# EAGLE design 0351_AD_ConverterRev020001 (EAGLE 9.6.2)
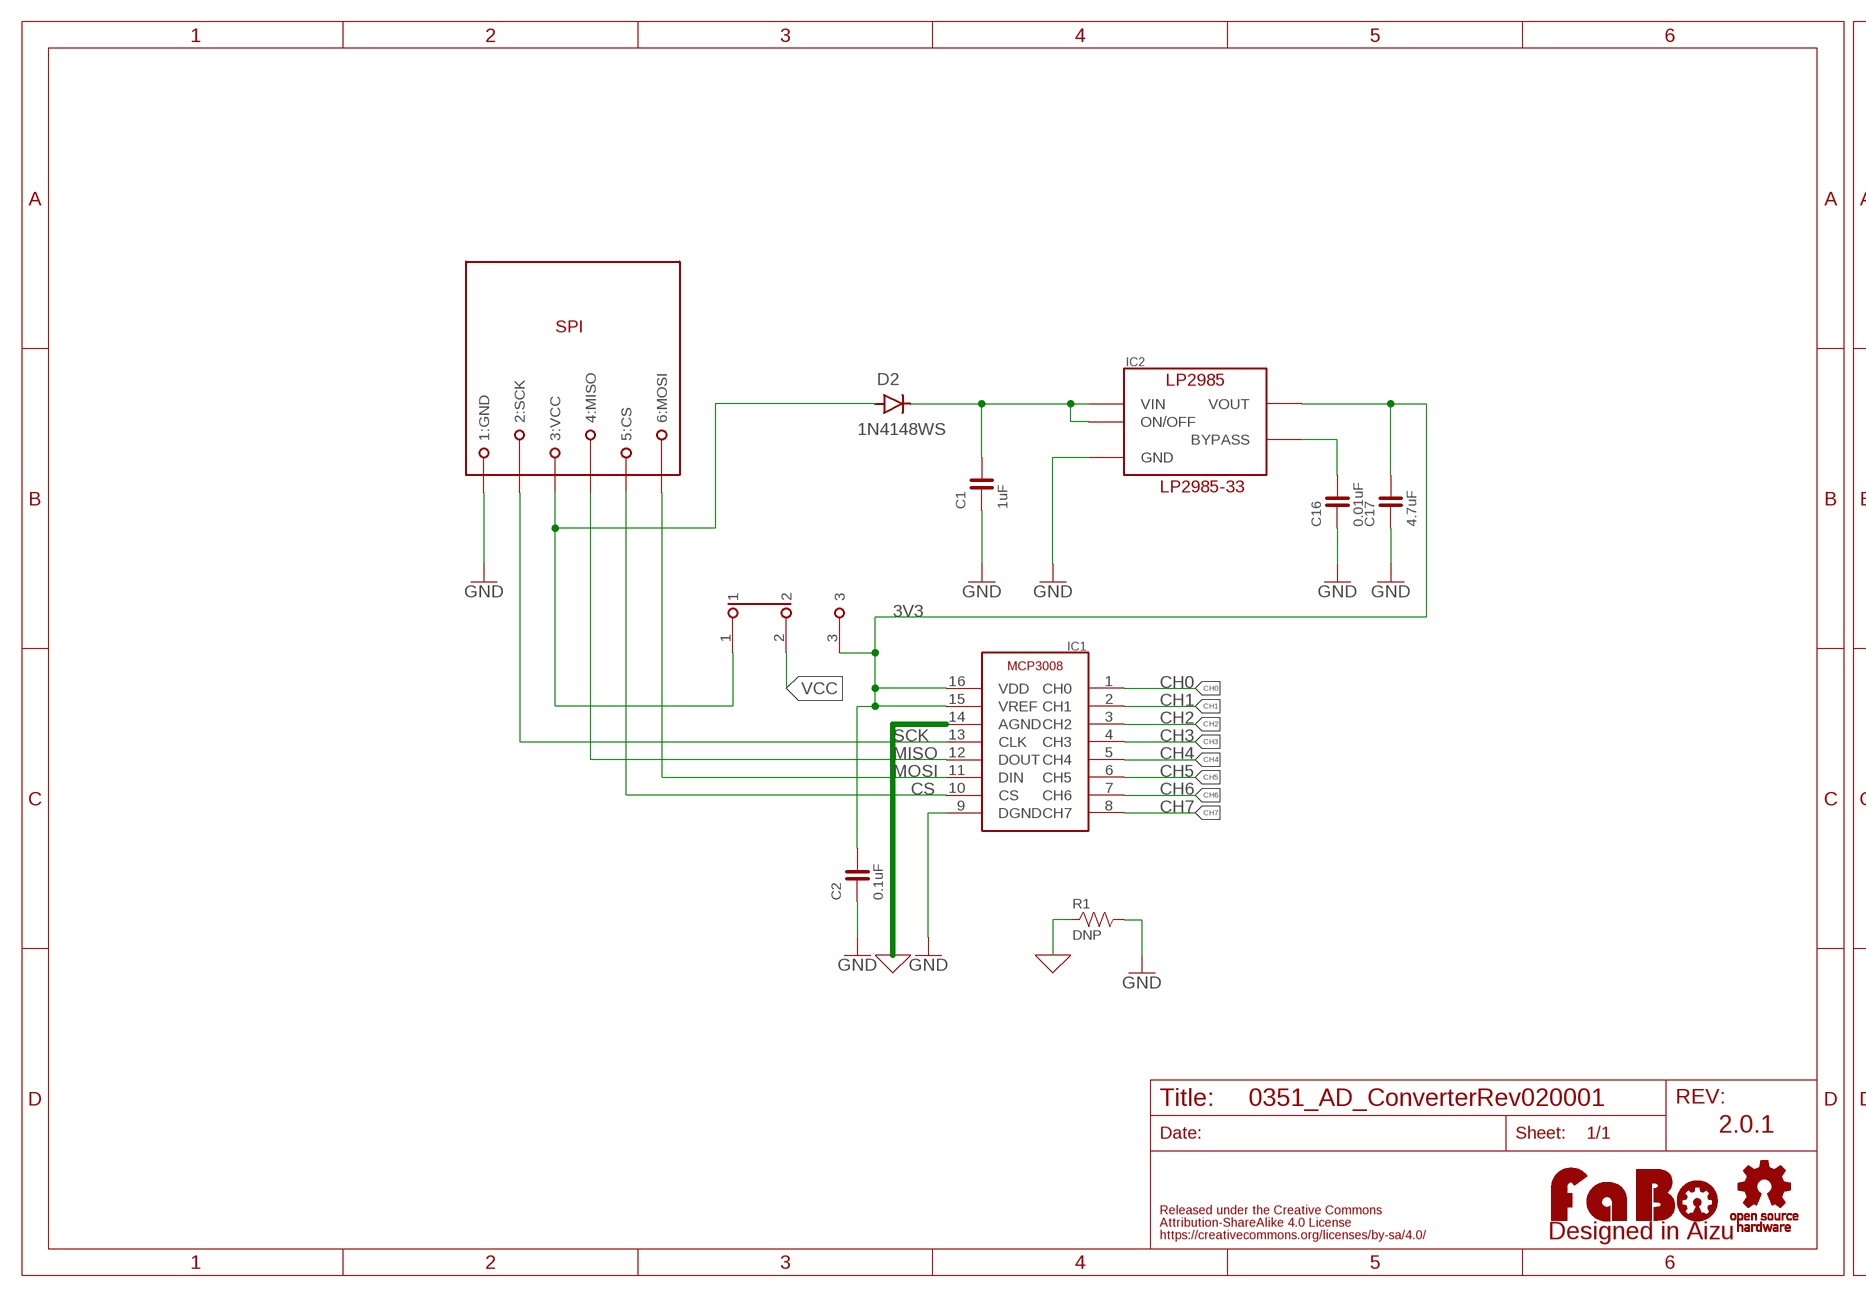
[diagram p0: schematic, sheet 1, part 1 of 2]
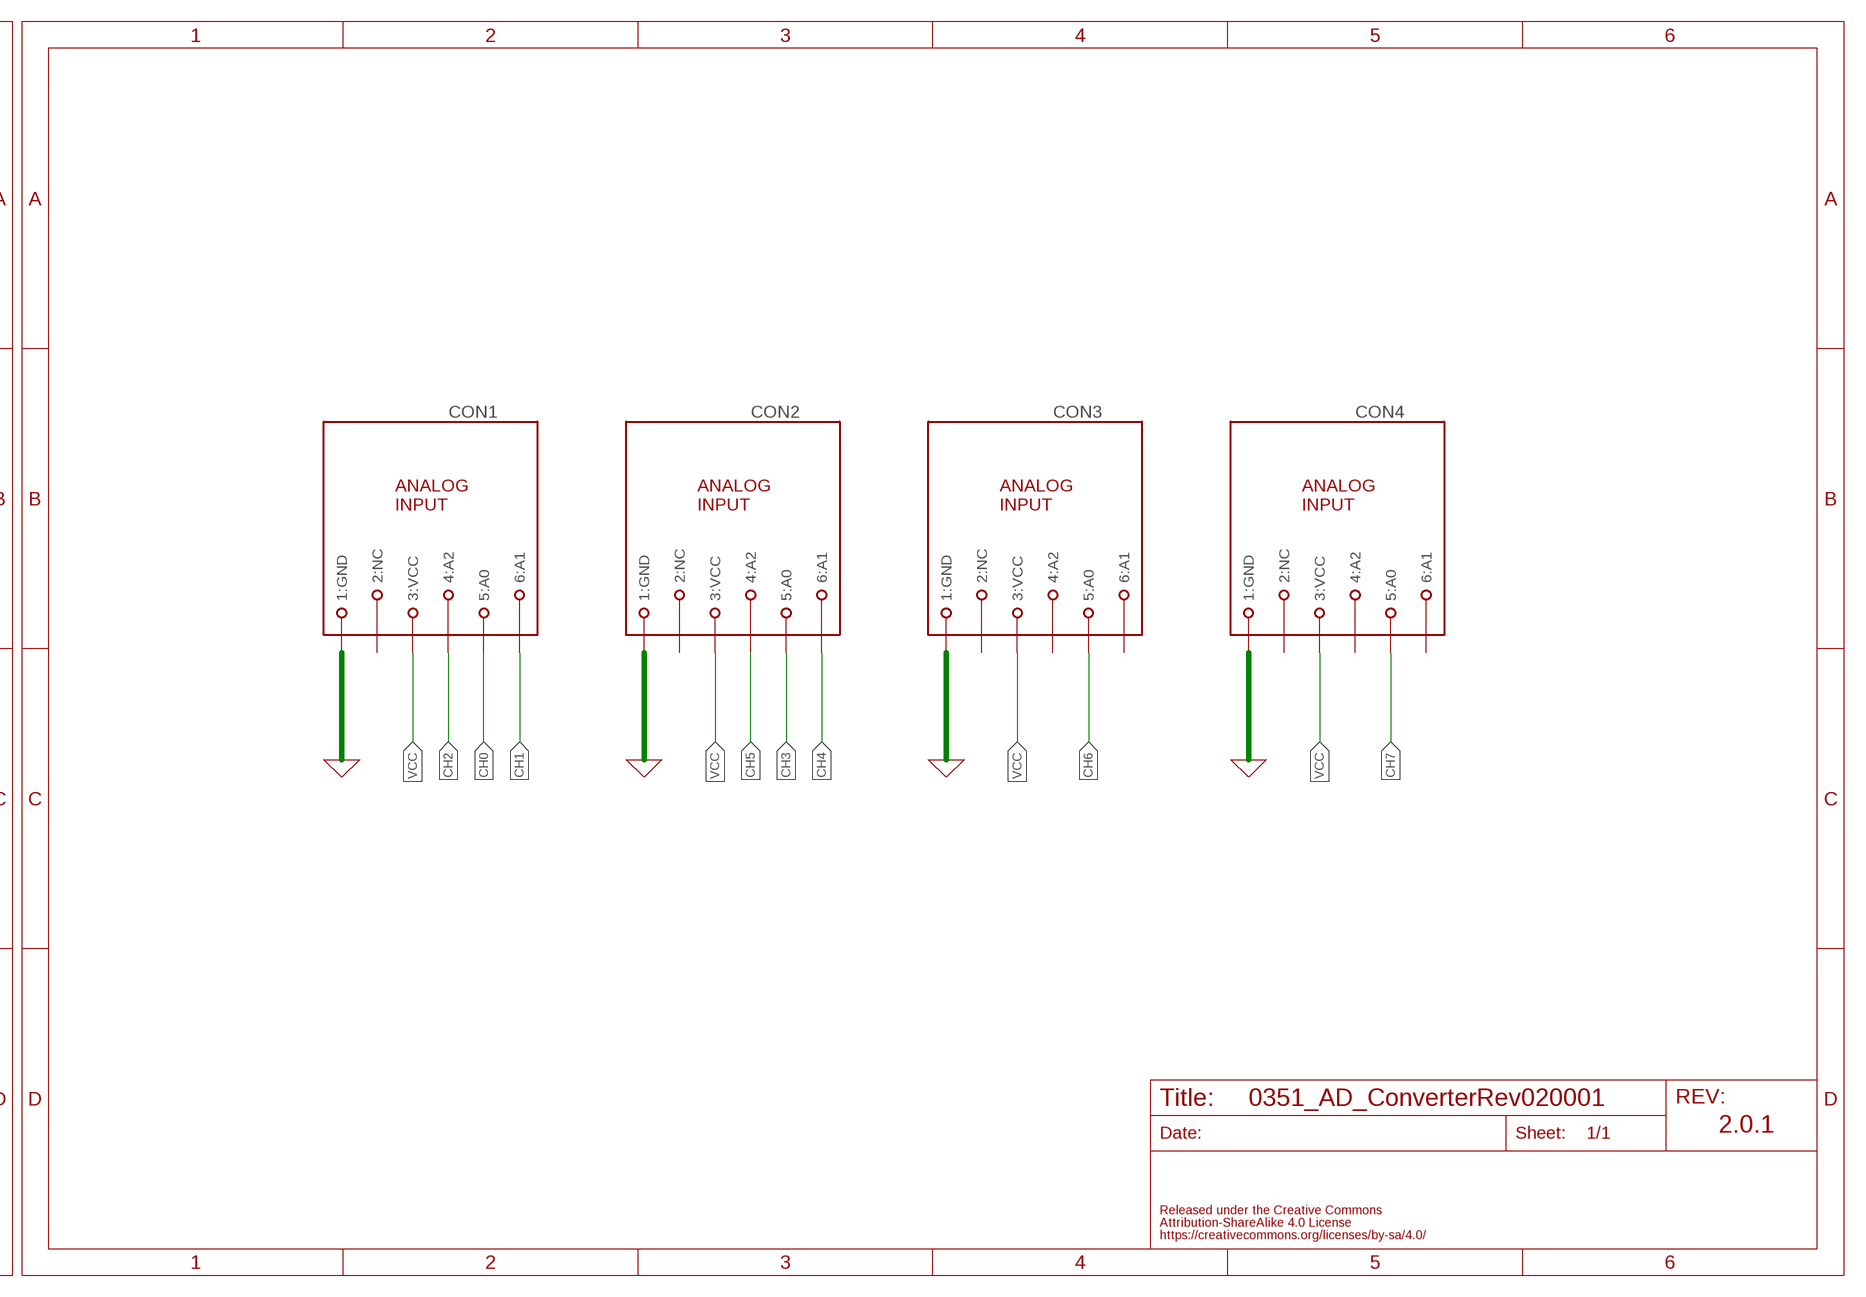
[diagram p1: schematic, sheet 1, part 2 of 2]

## Parts
C1  1uF  CAPACITOR-0603  [0603]
C2  0.1uF  CAPACITOR-0603  [0603]
C16  0.01uF  CAPACITOR-0603  [0603]
C17  4.7uF  CAPACITOR-0603  [0603]
CON1  MODULAR-JACK-6P-RJ11_ANALOG3  [7002-6PXC-X]
CON2  MODULAR-JACK-6P-RJ11_ANALOG3  [7002-6PXC-X]
CON3  MODULAR-JACK-6P-RJ11_ANALOG3  [7002-6PXC-X]
CON4  MODULAR-JACK-6P-RJ11_ANALOG3  [7002-6PXC-X]
D2  1N4148WS  [SOD-323]
IC1  MICROCHIP-MCP3008  [MICROCHIP-MCP3008]
IC2  LP2985-33DBV  [SOT-23-5]
LCD-SPI_RJ11  MODULAR-JACK-6P-RJ11_SPI  [7002-6PXC-X]
LOGO1  LOGO_FABO-M_BOTTOM  [LOGO_FABO_M_BOTTOM]
R1  DNP  RESISTOR-0805  [0805]
U$3  LOGO_OSHW-M_BOTTOM  [LOGO_OSHW_M_BOTTOM]
U$5  SSSS213202  [SSSS213202]

## Nets
3V3: C2.2 C17.2 IC1.15(VREF) IC1.16(VDD) IC2.5(VOUT) U$5.3
AGND: CON1.1(1:GND) CON2.1(1:GND) CON3.1(1:GND) CON4.1(1:GND) IC1.14(AGND) R1.1 ; supply symbol labelled GND
CH0: CON1.5(5:A0) IC1.1(CH0)
CH1: CON1.6(6:A1) IC1.2(CH1)
CH2: CON1.4(4:A2) IC1.3(CH2)
CH3: CON2.5(5:A0) IC1.4(CH3)
CH4: CON2.6(6:A1) IC1.5(CH4)
CH5: CON2.4(4:A2) IC1.6(CH5)
CH6: CON3.5(5:A0) IC1.7(CH6)
CH7: CON4.5(5:A0) IC1.8(CH7)
CS: IC1.10(CS) LCD-SPI_RJ11.5(5:CS)
GND: C1.1 C2.1 C16.1 C17.1 IC1.9(DGND) IC2.2(GND) LCD-SPI_RJ11.1(1:GND) R1.2
MISO: IC1.12(DOUT) LCD-SPI_RJ11.4(4:MISO)
MOSI: IC1.11(DIN) LCD-SPI_RJ11.6(6:MOSI)
N$7: C16.2 IC2.4(BYPASS)
N$8: C1.2 D2.C IC2.1(VIN) IC2.3(ON/OFF)
SCK: IC1.13(CLK) LCD-SPI_RJ11.2(2:SCK)
VCC: CON1.3(3:VCC) CON2.3(3:VCC) CON3.3(3:VCC) CON4.3(3:VCC) U$5.2
VCC_IN: D2.A LCD-SPI_RJ11.3(3:VCC) U$5.1
Unconnected: CON1.2(2:NC) CON2.2(2:NC) CON3.2(2:NC) CON3.4(4:A2) CON3.6(6:A1) CON4.2(2:NC) CON4.4(4:A2) CON4.6(6:A1)

## Notes on the sheet
- LP2985-33
- 2.0.1 | 2.0.1

## Library data of the parts
C1 C2 C16 C17 = FaBo-Capacitor:CAPACITOR: CAPACITOR
CON1 CON2 CON4 = FaBo-Connetor:MODULAR-JACK-6P-RJ11_ANALOG3
CON3 = FaBo-Connetor:MODULAR-JACK-6P-RJ11_ANALOG3; SPICEPREFIX: X
D2 = Diodes:1N4148WS: DIODE GEN PURP 75V 150MA SOD323F Manufacturer's datasheet <https://www.onsemi.com/pub/Collateral/1N914BWS-D.pdf>; CREATED_BY: PCBLayout.com; DIGIKEY_PART_NUMBER: 1N4148WSFSTR-ND; MANUFACTURER: Diodes Incorporated; MPN: 1N4148WS; PACKAGE: SOD-323
IC1 = FaBo-ADC:MICROCHIP-MCP3008
IC2 = FaBo-Supply:LP2985: LP2985
LCD-SPI_RJ11 = FaBo-Connetor:MODULAR-JACK-6P-RJ11_SPI
LOGO1 = component:LOGO_FABO
R1 = FaBo-Resistors:RESISTOR: RESISTOR
U$3 = component:LOGO_OSHW
U$5 = FaBo-Switch:SSSS213202

## Board
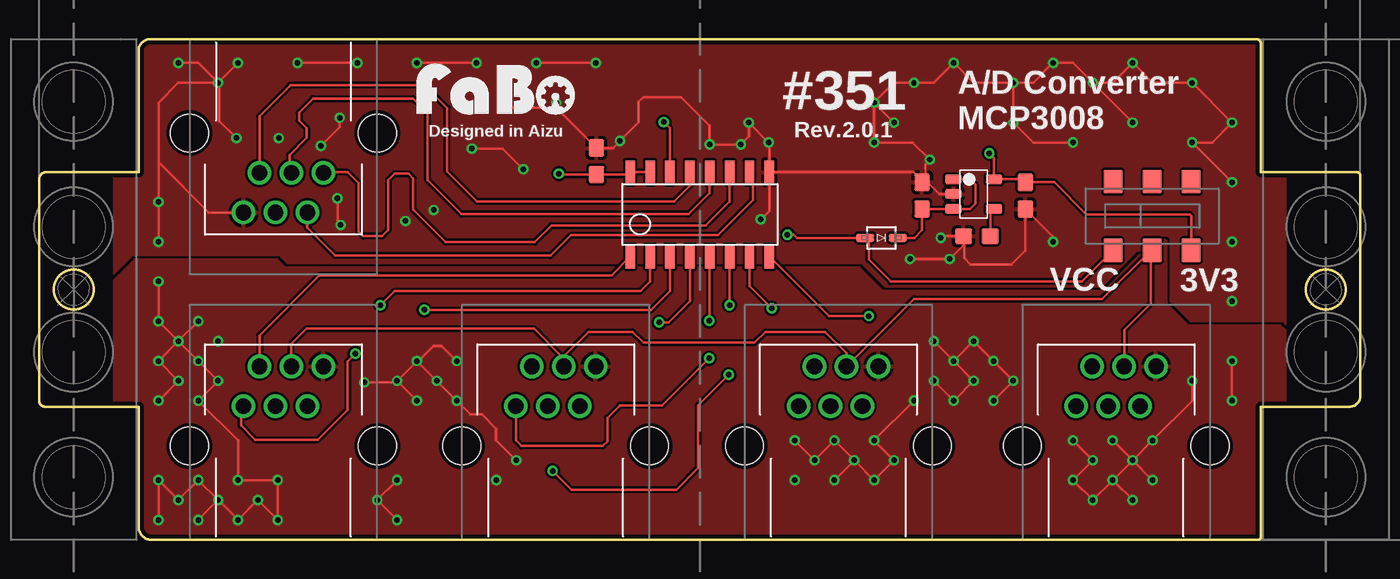
[diagram p2: board, top side]
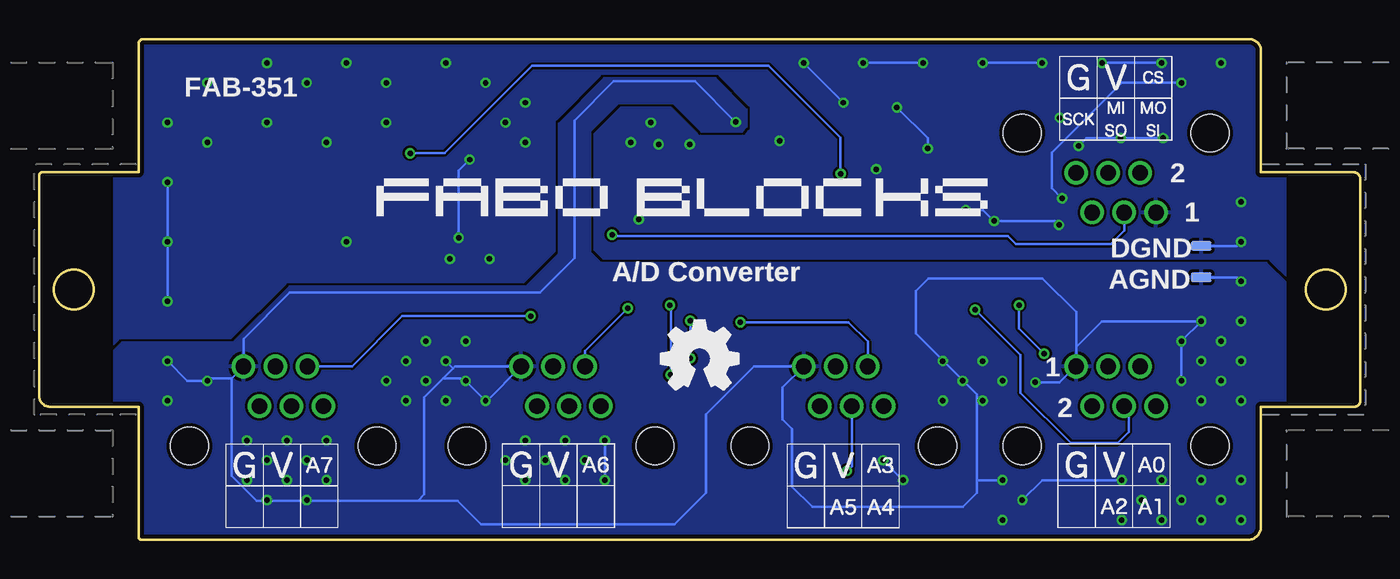
[diagram p3: board, bottom side, seen from below]

Size 84.4 x 32 mm. Coordinates in mm from the lower left corner, seen from the top.
Outline: 7.15,32 77.75,32 arc-90 78.05,31.7 78.05,23.5 84.1,23.5 arc-90 84.4,23.3 84.4,9.2 arc-90 83.7,8.5 78.05,8.5 78.05,0.2 arc-90 77.85,0 7.2,0 arc-90 6.35,0.8 6.35,8.5 0.4,8.5 arc-90 0,8.9 0,23 arc-90 0.4,23.5 6.35,23.5 6.35,31.3 arc-90 7.15,32
Outline: circle at 82.2,16 radius 1.27
Outline: circle at 2.2,16 radius 1.27
Copper layers (1*16): Top 0.035mm / dielectric 1.6mm / Bottom 0.035mm
Design rules "PCBway": minimum track width 6mil, minimum drill 12mil, track to track 6mil, track to pad 6mil, pad to pad 6mil, via to via 6mil, smd to smd 6mil, copper to edge 10mil, drill to drill 10mil, minimum pad ring 10mil, minimum via ring 6mil, stop-mask expansion 2mil, vias tented up to drill 100mil, thermal gap 8mil
tRestrict: area -1.2,7.3 to 4.7,24.4; area 79.7,7.4 to 85.6,24.5
bRestrict: area -1.2,6.6 to 4.7,23.7; area 79.7,7.4 to 85.6,24.5

### Footprints (pad centres in the part's own frame; a part is rotated, then mirrored left to right if it is on the bottom)
0603 = smd 1.1 x 1: 1 -0.85,0; 2 0.85,0
7002-6PXC-X = drill 1: 1 2.55,5.08; 2 1.53,2.54; 3 0.51,5.08; 4 -0.51,2.54; 5 -1.53,5.08; 6 -2.55,2.54 | hole 2.4: -6,0; 6,0
SOD-323 = smd 1.14 x 0.52: A 1.04,0; C -1.04,0
MICROCHIP-MCP3008 = smd 0.6 x 1.5: 1 -4.445,-2.7; 2 -3.175,-2.7; 3 -1.905,-2.7; 4 -0.635,-2.7; 5 0.635,-2.7; 6 1.905,-2.7; 7 3.175,-2.7; 8 4.445,-2.7; 9 4.445,2.7; 10 3.175,2.7; 11 1.905,2.7; 12 0.635,2.7; 13 -0.635,2.7; 14 -1.905,2.7; 15 -3.175,2.7; 16 -4.445,2.7
SOT-23-5 = smd 0.6 x 1.05: 1 -0.95,-1.3; 2 0,-1.3; 3 0.95,-1.3; 4 0.95,1.3; 5 -0.95,1.3
0805 = smd 0.6 x 1.3: 1 -1,0; 2 1,0
SSSS213202 = smd 1.2 x 1.5: 1 -2.5,-2.2; 2 0,-2.2; 3 2.5,-2.2; 4 2.5,2.2; 5 0,2.2; 6 -2.5,2.2

### Placement (x,y rotation side)
C1  56.4,22 270 top
C2  35.6,24.2 270 top
C16  59.9,19.4 0 top
C17  63,22 90 top
CON1  15.6,6 0 top
CON2  33,6 0 top
CON3  51.06,6 0 top
CON4  68.8,6 0 top
D2  53.8,19.3 180 top
IC1  42.2,20.8 0 top
IC2  59.7,22.1 270 top
LCD-SPI_RJ11  15.6,26 180 top
LOGO1  29.17,26.8 0 bottom
R1  10.16,17.78 90 bottom
U$2  [4-1BLOCK]  2.2,16 0 top
U$3  42.2,11.58 0 top
U$4  [4-1BLOCK]  82.2,16 180 top
U$5  71.1,20.7 0 top

### Tracks (layer width: path | path; a pad name or v marks a point on that pad's centre or on a via)
3V3  (via drill 0.35)
  Top 0.152: U$5.3 73.6,20.7 73.5,20.8 66.9,20.8 64.85,22.85 63.1,22.85 | 63.1,22.85 C17.2 | 63.1,22.85 62.9,23.05 IC2.5 61,24.4 v60.7,24.7 | IC1.15 IC1.16 37.61,23.35 C2.2 33.25,23.35 v33.2,23.4
  Bottom 0.152: v33.2,23.4 33.2,25.7 37.8,30.3 52.9,30.3 58.5,24.7 v60.7,24.7
AGND  (via drill 0.35)
  Top 0.152: IC1.14 40.3,26.3 v39.9,26.7 | v55.88,8.89 v53.34,6.35 v54.61,5.08 v53.34,3.81 v52.07,5.08 | v7.62,1.27 v7.62,3.81 v8.89,2.54 v10.16,3.81 v11.43,2.54 | v11.43,2.54 v10.16,1.27 | v11.43,2.54 v12.7,1.27 v13.97,2.54 v15.24,1.27 v15.24,3.81 v12.7,3.81 12.7,6.35 v10.16,8.89 v11.43,10.16 v10.16,11.43 v8.89,12.7 | v7.62,8.89 v8.89,10.16 v7.62,11.43 v8.89,12.7 | v8.89,12.7 v7.62,13.97 v7.62,16.51 | v8.89,12.7 v10.16,13.97 | 24.18,11.38 v24.13,11.43 v22.86,10.16 | 24.18,11.38 v25.4,10.16 v26.67,8.89 27.56,8 28.3,8 29.2,7.1 29.2,6.36 v30.48,5.08 | v22.86,3.81 v21.59,2.54 v22.86,1.27 | v26.67,11.43 25.7,12.4 25.2,12.4 24.18,11.38 | v24.13,8.89 v22.86,10.16 | v20.76,10.06 22.76,10.06 v22.86,10.16 | v48.26,6.35 v49.53,5.08 v50.8,6.35 v52.07,5.08 | v52.07,5.08 v50.8,3.81 | v57.15,10.16 v58.42,8.89 v59.69,10.16 v58.42,11.43 | v58.42,11.43 v57.15,12.7 | v58.42,11.43 v59.69,12.7 v60.96,11.43 v62.23,10.16 v60.96,8.89 | v66.04,6.35 v67.31,5.08 v66.04,3.81 v67.31,2.54 68.49,3.71 | 68.49,3.71 v68.58,3.81 v69.85,5.08 | v69.85,5.08 v68.58,6.35 | v69.85,5.08 v71.12,6.35 73.66,8.89 v73.66,10.16 | v69.85,5.08 v71.12,3.81 | v69.85,2.54 68.68,3.71 68.49,3.71 | v76.2,11.43 v76.2,8.89
  Bottom 0.152: v39.9,26.7 42.5,29.3 47.7,29.3 50.2,26.8 50.2,18 52.4,15.8 68.4,15.8 71.35,12.85 CON4.1 72.1,10.33 | 60.2,2.5 59.8,2.9 59.8,9.1 58.58,10.32 | 60.2,2.5 57.66,2.5 56.16,1 43.8,1 41.8,3 41.8,8 38.72,11.08 CON2.1 36.9,9.73 36.9,7.7 36.3,7.1 36.3,3.4 35,2.1 25.4,2.1 24.5,3 24.5,3.81 | 60.2,2.5 70.5,2.5 72.1,4.1 72.1,10.33 | 57.95,10.96 57.82,11.08 CON3.1 55.8,8.89 v55.88,8.89 v57.15,10.16 57.31,10.32 58.58,10.32 | 57.95,10.96 58.58,10.32 | 18.15,12.33 18.15,14.55 20.3,16.7 27.6,16.7 28.4,15.9 28.4,13.2 24.5,9.3 24.5,3.81 | 18.15,12.33 16.51,13.97 v10.16,13.97 v11.43,12.7 v11.43,10.16 | v15.24,3.81 20.32,3.81 v21.59,2.54 | v22.86,3.81 24.5,3.81 | v29.21,3.81 v30.48,5.08 | v48.26,3.81 v48.26,6.35 | v58.42,11.43 57.95,10.96 | 72.1,10.33 73.49,10.33 v73.66,10.16 74.93,10.16 v76.2,11.43 | 18.15,12.33 CON1.1 18.22,11.08 19.24,10.06 v20.76,10.06 | R1.1 7.89,16.78 v7.62,16.51
  pour Bottom: 5.6,-0.1 5.6,6.9 4.7,7.8 4.7,16.4 6,17.7 48.5,17.7 49.2,18.4 49.2,26.1 47.4,27.9 43.9,27.9 42.1,26.1 39.5,26.1 39.2,26.4 39.2,27.5 41.2,29.5 48.3,29.5 51.2,26.6 51.2,18.3 53.3,16.2 68.4,16.2 72,12.6 79.1,12.6 80.1,11.6 80.1,0.8 78.1,-1.2 6.7,-1.2
  pour Top: 4.6,7.8 4.6,16.4 6.1,17.9 15.2,17.9 15.7,17.4 52.4,17.4 53.9,15.9 68,15.9 70.2,18.1 70.4,18.3 70.4,19.1 70.7,19.4 70.8,19.4 71.7,19.4 71.8,19.3 72,19.1 72,15.1 73.4,13.7 79.3,13.7 79.6,13.4 79.6,13 79.6,0.8 77.8,-1 7.1,-1 5.7,0.4 5.7,6.7
CH0
  Top 0.152: IC1.1 36.56,16.9 17.9,16.9 14.07,13.07 CON1.5
CH1  (via drill 0.35)
  Top 0.152: IC1.2 39.03,16.52 38.4,15.9 22.7,15.9 v21.8,15 | CON1.6 12.9,8.39 12.9,7.3 13.8,6.4 17.8,6.4 19.7,8.3 19.7,11.4 v20.2,11.9
  Bottom 0.152: v20.2,11.9 21.8,13.5 v21.8,15
CH2  (via drill 0.35)
  Top 0.152: IC1.3 40.3,15.89 39.1,14.7 v24.6,14.7
  Bottom 0.152: v24.6,14.7 21.7,11.8 21.7,9.4 18.5,6.2 15.5,6.2 14.8,6.9 14.8,8.25 CON1.4
CH3  (via drill 0.35)
  Top 0.152: IC1.4 41.57,15.27 40.2,13.9 v39.6,13.9
  Bottom 0.152: v39.6,13.9 32.7,13.9 31.47,12.67 CON2.5
CH4  (via drill 0.35)
  Top 0.152: CON2.6 30.45,6.35 30.8,6 36,6 36.3,6.3 36.3,7.8 37.1,8.6 39.8,8.6 v42.8,11.6 | IC1.5 42.84,14.04 v42.8,14
  Bottom 0.152: v42.8,14 v42.8,11.6
CH5  (via drill 0.35)
  Top 0.152: v32.8,4.4 34,3.2 40.7,3.2 42.1,4.6 42.1,8.6 v44.05,10.55 | IC1.6 v44.11,15.01 v44.1,15
  Bottom 0.152: v32.8,4.4 32.49,4.71 CON2.4 | v44.05,10.55 44.05,14.95 v44.1,15
CH6  (via drill 0.35)
  Top 0.152: IC1.7 45.38,16.23 v46.8,14.8
  Bottom 0.152: v46.8,14.8 49.53,12.07 CON3.5
CH7  (via drill 0.35)
  Top 0.152: IC1.8 50.45,14.3 v53,14.3
  Bottom 0.152: v53,14.3 61.2,14.3 64.42,11.08 CON4.5
CS
  Top 0.152: IC1.10 45.6,23.27 45.6,21.7 43.37,19.47 33.97,19.47 32.67,18.16 18.92,18.16 17.13,19.95 LCD-SPI_RJ11.5
GND  (via drill 0.35)
  Top 0.152: IC1.9 46.65,25.36 v46.6,25.4 45.35,26.65 | v57.6,19.3 57.7,19.4 C16.1 59.1,19.35 59.1,18.88 | IC2.2 57.5,22.1 56.75,22.85 56.5,22.85 | 56.5,22.85 C1.1 56.6,23.05 56.6,24 v56.9,24.3 55.8,25.4 v53.34,25.4 v53.34,27.94 | 59.1,18.88 59.1,18 59.5,17.6 62.1,17.6 63,18.5 C17.1 64.77,19.38 v64.77,19.05 | IC1.9 55.85,23.5 56.5,22.85 | 7.62,24.13 7.62,27.94 8.89,29.21 v11.43,29.21 | v66.04,25.4 63.5,25.4 v62.23,26.67 v62.23,29.21 | v53.34,27.94 54.61,29.21 v55.88,29.21 57.15,29.21 v58.42,30.48 59.69,29.21 v62.23,29.21 | v12.7,30.48 11.51,29.29 | 11.51,29.29 v11.43,29.21 | v8.89,30.48 10.16,30.48 v11.43,29.21 | v7.62,19.05 v7.62,21.59 7.62,24.13 | v55.63,17.95 v58.17,17.95 59.1,18.88 | v54.61,26.67 v53.34,27.94 | v45.33,26.67 45.35,26.65 | v76.2,22.86 v73.66,25.4 74.93,25.4 v76.2,26.67 v73.66,29.21 71.12,29.21 v69.85,30.48 68.58,29.21 67.4,29.21 | 67.4,29.21 v67.31,29.21 66.04,30.48 v64.77,30.48 63.5,29.21 v62.23,29.21 | v69.85,26.67 67.4,29.12 67.4,29.21 | 45.35,26.65 45.35,25.79 v44.83,25.27 v42.83,25.27 42.83,26.47 41,28.3 38.6,28.3 38.3,28 38.3,26.7 v37.1,25.5 36.65,25.05 C2.1 33.02,27.63 v33.02,27.94 32.72,27.64 v29.61,27.64 | IC1.9 46.65,21.02 v46.1,20.48 | v19.25,20.12 19.05,20.32 v19.05,21.82 | v16.51,30.48 v20.32,30.48 | v24.13,30.48 v27.94,30.48 | v31.75,30.48 v35.56,30.48 | v27.64,25 29.61,25 v30.93,23.69 | v12.6,25.68 11.51,26.77 11.51,29.29 | v18,25.18 19.2,26.38 v19.2,26.98 | LCD-SPI_RJ11.1 10.83,20.92 7.62,24.13
  Bottom 0.152: v57.6,19.3 57.6,23.6 v56.9,24.3 | v11.43,29.21 15.24,29.21 19.71,24.74 19.71,22.48 v19.05,21.82 | v76.2,15.24 v76.2,19.05 v76.2,22.86 | v19.25,20.12 19.51,20.38 v23.4,20.38 24.1,21.08 v25.2,21.08 | v12.7,30.48 v16.51,30.48 | v20.32,30.48 v24.13,30.48 | v27.94,30.48 v31.75,30.48 | v35.56,30.48 v33.02,27.94 | v29.61,27.64 27.64,25.66 v27.64,25 | v12.6,25.68 v15.3,25.68 17.5,25.68 v18,25.18 | R1.2 7.89,18.78 v7.62,19.05
  pour Bottom (rank 6): -3.3,-3 87.3,-3 87.3,35.9 -3.3,35.9
  pour Top (rank 6): -2.6,-1.9 86.6,-1.9 86.6,34.1 -2.6,34.1
MISO
  Top 0.152: IC1.12 42.84,22.18 41.47,20.8 27,20.8 24.8,23 24.8,27.3 23.9,28.2 17.5,28.2 16.6,27.3 16.6,26.8 17.1,26.3 17.1,25.7 16,24.6 16,23.57 LCD-SPI_RJ11.4
MOSI
  Top 0.152: IC1.11 44.11,21.62 42.58,20.09 32.73,20.09 31.66,19.02 25.98,19.02 23.9,21.1 23.9,23.1 23.6,23.4 22.7,23.4 22.3,23 22.3,19.8 21.9,19.4 20.7,19.4 20.4,19.7 20.4,22.8 19.7,23.5 18.19,23.5 LCD-SPI_RJ11.6
N$7
  Top 0.152: C16.2 60.75,20.9 IC2.4
N$8
  Top 0.152: D2.C 55.9,19.3 56.4,19.8 C1.2 IC2.3 59.45,21.15 59.8,21.5 59.8,22.7 59.45,23.05 IC2.1
SCK
  Top 0.152: IC1.13 41.57,22.65 40.54,21.62 27.98,21.62 26.06,23.54 26.06,27.6 24.61,29.06 16.06,29.06 14.07,27.07 LCD-SPI_RJ11.2
VCC
  Top 0.152: U$5.2 71.1,19 71,18.9 71,18.5 | 71,18.5 71,15.1 69.31,13.41 CON4.3 | 71,18.5 67.9,15.4 55.89,15.4 CON3.3 51.57,11.93 50.2,13.3 46.4,13.3 45.7,12.6 38.6,12.6 37.9,13.3 35.1,13.3 33.51,11.71 33.51,11.6 | CON2.3 33.51,11.6 | CON1.3 16.11,12.51 17.1,13.5 31.61,13.5 33.51,11.6
VCC_IN  (via drill 0.35)
  Top 0.152: U$5.1 66.6,16.5 54.4,16.5 53,17.9 53,19.06 D2.A 48.4,19.3 48.2,19.5 v47.8,19.5
  Bottom 0.152: v47.8,19.5 47.7,19.4 22.5,19.4 22,18.9 15.95,18.9 15.09,19.76 LCD-SPI_RJ11.3

### Text on the board
tPlace: Designed in Aizu | #351 | Rev.2.0.1 | A/D Converter / MCP3008 | VCC | 3V3
bPlace: FAB-351 | 2 | 1 | DGND | AGND | A/D Converter | A/D Converter | 1 | 2
Document: #351 A/D Converter(MCP3008)FaBo BLOCKS Rev2.0.1 / 2022/08/29 / ID 2